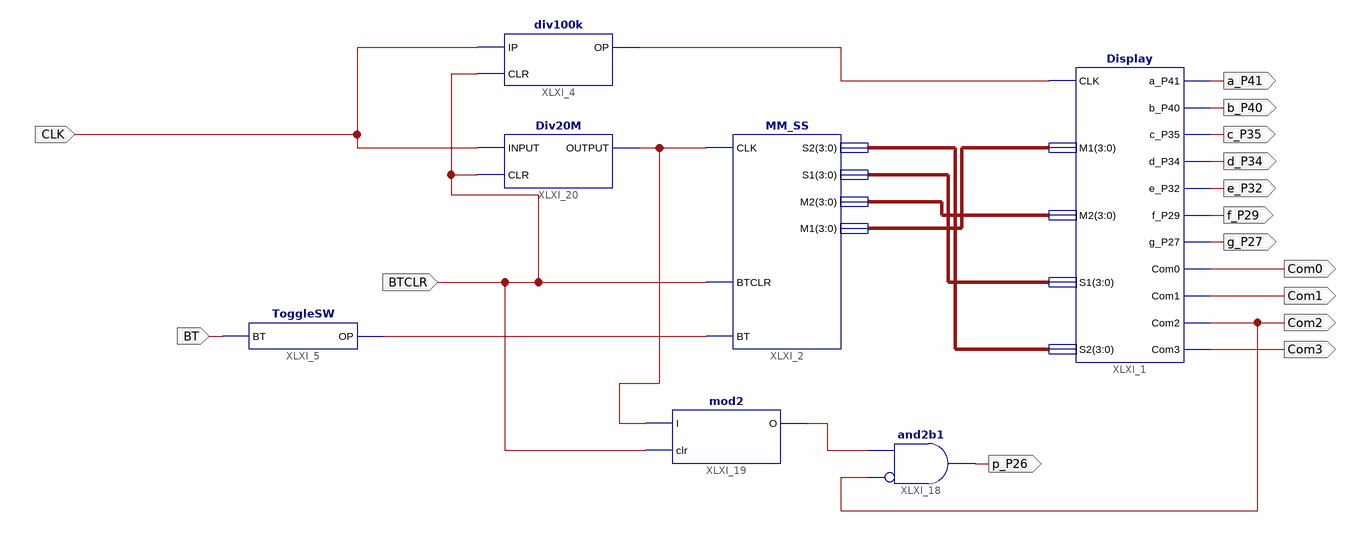
[diagram p0: schematic sheet 1]
// Xilinx ISE schematic Lab7.sch (spartan6) as structural Verilog: 7 symbols, 15 ports
module Lab7 (
  input  BTCLR,
  input  CLK,
  input  BT,
  output a_P41,
  output b_P40,
  output c_P35,
  output d_P34,
  output e_P32,
  output f_P29,
  output g_P27,
  output Com0,
  output Com3,
  output p_P26,
  output Com2,
  output Com1
);

  wire XLXN_7, XLXN_61, XLXN_63, XLXN_68;
  wire [3:0] XLXN_2, XLXN_3, XLXN_4, XLXN_5;

  Display XLXI_1 (
    .CLK(XLXN_7), .S2(XLXN_2), .S1(XLXN_3), .M2(XLXN_4), .M1(XLXN_5), .a_P41(a_P41), .b_P40(b_P40),
    .c_P35(c_P35), .d_P34(d_P34), .e_P32(e_P32), .f_P29(f_P29), .g_P27(g_P27), .Com0(Com0), .Com1(Com1),
    .Com2(Com2), .Com3(Com3));
  MM_SS XLXI_2 (.CLK(XLXN_68), .BTCLR(BTCLR), .S2(XLXN_2), .S1(XLXN_3), .M2(XLXN_4), .M1(XLXN_5), .BT(XLXN_63));
  div100k XLXI_4 (.IP(CLK), .CLR(BTCLR), .OP(XLXN_7));
  and XLXI_18 (p_P26, ~Com2, XLXN_61);  // and2b1
  mod2 XLXI_19 (.I(XLXN_68), .clr(BTCLR), .O(XLXN_61));
  Div20M XLXI_20 (.INPUT(CLK), .CLR(BTCLR), .OUTPUT(XLXN_68));
  ToggleSW XLXI_5 (.OP(XLXN_63), .BT(BT));
endmodule
